# EAGLE design i2c_adc_avr_inline (EAGLE 6.4)
DATABASE: /home/mes/eagle/PARTSDB.txt
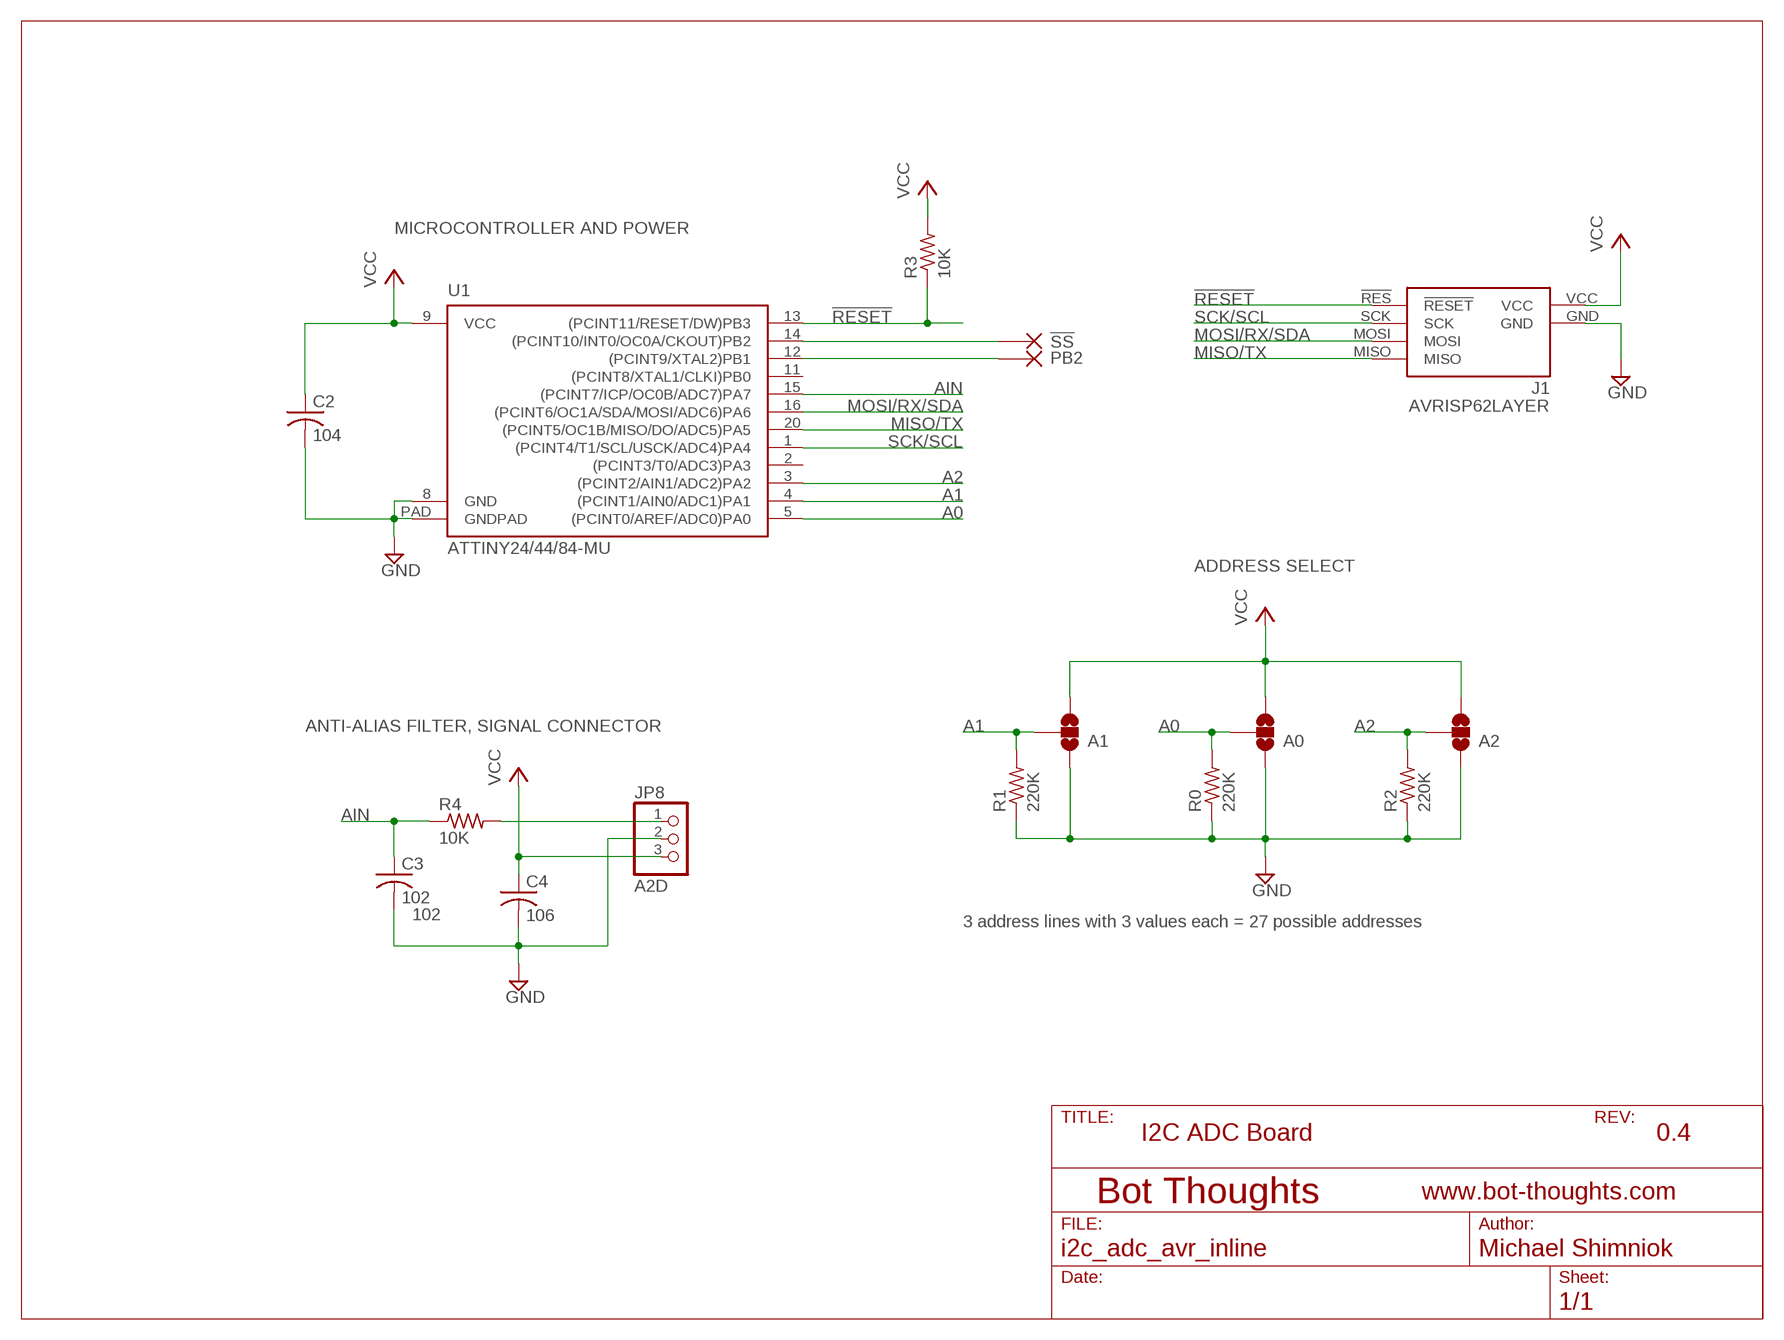
[diagram p0: schematic, sheet 1]

## Parts
A0  SOLDERJUMPER_2WAYS  [SJ_3]
A1  SOLDERJUMPER_2WAYS  [SJ_3]
A2  SOLDERJUMPER_2WAYS  [SJ_3]
C2  104  C-USC0603  [C0603]
C3  102  C-USC0603  [C0603]
C4  106  C-USC0603  [C0603]
J1  AVRISP62LAYER  [2X3_2LAYER]
JP8  A2D  PINHD-1X03_2.54-S  [1X03-S]
R0  220K  R-US_R0603  [R0603]
R1  220K  R-US_R0603  [R0603]
R2  220K  R-US_R0603  [R0603]
R3  10K  R-US_R0603  [R0603]
R4  10K  R-US_R0603  [R0603]
U1  ATTINY24/44/84-MU  [20MLF_0.5]
X1  !SS  PINPADSMD0.07X0.15  [PAD0.07X0.15]
X4  PB2  PINPADSMD0.07X0.15  [PAD0.07X0.15]

## Nets
!RESET: J1.!RES(!RESET) R3.1 U1.13((PCINT11/RESET/DW)PB3)
A0: A0.2 R0.2 U1.5((PCINT0/AREF/ADC0)PA0)
A1: A1.2 R1.2 U1.4((PCINT1/AIN0/ADC1)PA1)
A2: A2.2 R2.2 U1.3((PCINT2/AIN1/ADC2)PA2)
AIN: C3.1 R4.1 U1.15((PCINT7/ICP/OC0B/ADC7)PA7)
GND: A0.1 A1.1 A2.1 C2.2 C3.2 C4.2 J1.GND JP8.2 R0.1 R1.1 R2.1 U1.8(GND) U1.PAD(GNDPAD)
MISO/TX: J1.MISO U1.20((PCINT5/OC1B/MISO/DO/ADC5)PA5)
MOSI/RX/SDA: J1.MOSI U1.16((PCINT6/OC1A/SDA/MOSI/ADC6)PA6)
N$1: JP8.1 R4.2
N$3: U1.14((PCINT10/INT0/OC0A/CKOUT)PB2) X1.P$1
N$4: U1.12((PCINT9/XTAL2)PB1) X4.P$1
SCK/SCL: J1.SCK U1.1((PCINT4/T1/SCL/USCK/ADC4)PA4)
VCC: A0.3 A1.3 A2.3 C2.1 C4.1 J1.VCC JP8.3 R3.2 U1.9(VCC)
Unconnected: U1.2((PCINT3/T0/ADC3)PA3) U1.11((PCINT8/XTAL1/CLKI)PB0)

## Notes on the sheet
- MICROCONTROLLER AND POWER
- ADDRESS SELECT
- ANTI-ALIAS FILTER, SIGNAL CONNECTOR
- 3 address lines with 3 values each = 27 possible addresses
- I2C ADC Board | 0.4

## Library data of the parts
A0 A1 A2 = SparkFun:SOLDERJUMPER_2WAY: Solder Jumper 2 way solder jumper
C2 = rcl:C-US: CAPACITOR, American symbol; PARTNO: C1608X7R1E104K080AA
C3 = rcl:C-US: CAPACITOR, American symbol; CODE: 102; PARTNO: CL10B102KB8SFNC
C4 = rcl:C-US: CAPACITOR, American symbol; PARTNO: CL10A106MP8NNNC
J1 = mes_avr:AVRISP6: 6-pin dual-row connector for Atmel AVRISP programmer interface
JP8 = pinhead-2:PINHD-1X03: PIN HEADER
R0 R1 R2 = rcl:R-US_: RESISTOR, American symbol; PARTNO: RC1608J224CS
R3 R4 = rcl:R-US_: RESISTOR, American symbol; PARTNO: 1622829-1
U1 = mes_avr:ATTINY24/44/84: Atmel AVR ATtiny24/44/84 14-pin High Performance, Low Power AVR® 8-bit Microcontroller
X1 X4 = mes_electromech:PINPAD: PIN PAD (PINPAD) Generic pin pad connector

## Board
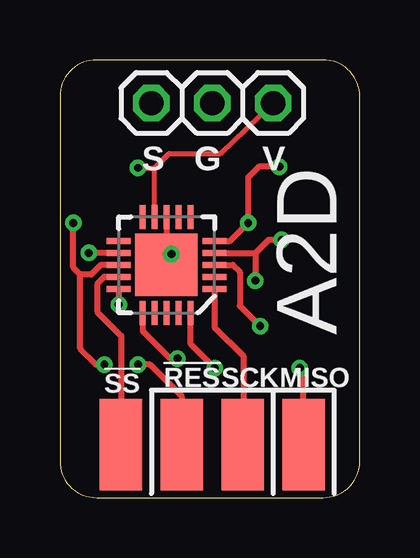
[diagram p1: board, top side]
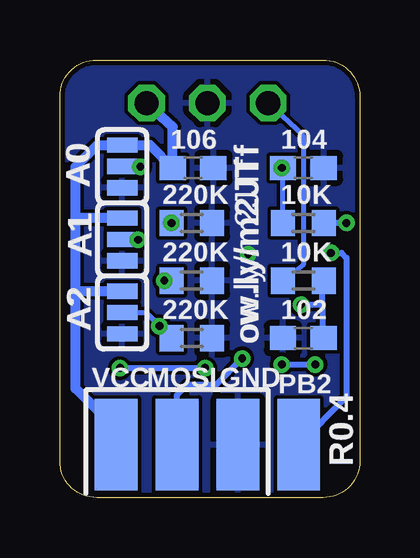
[diagram p2: board, bottom side, seen from below]

Size 12.51 x 18.25 mm. Coordinates in mm from the lower left corner, seen from the top.
Outline: 0,16.73 0,1.52 arc90 1.52,0 10.98,0 arc90 12.51,1.52 12.51,16.73 arc90 10.98,18.25 1.52,18.25 arc90 0,16.73
Copper layers (1*16): Top 0.0356mm / dielectric 1.5011mm / Bottom 0.0356mm
Design rules "default *": minimum track width 6mil, minimum drill 13mil, track to track 6mil, track to pad 6mil, pad to pad 6mil, via to via 6mil, smd to smd 6mil, copper to edge 8mil, drill to drill 6mil, minimum pad ring 7mil, minimum via ring 7mil, stop-mask expansion 4mil, vias tented up to drill 20mil, thermal gap 10mil

### Footprints (pad centres in the part's own frame; a part is rotated, then mirrored left to right if it is on the bottom)
SJ_3 = smd 0.635 x 1.27: 1 -0.889,0; 2 0,0; 3 0.889,0
C0603 = smd 1.1 x 1: 1 -0.85,0; 2 0.85,0
2X3_2LAYER = smd 1.778 x 3.81: !RES -2.54,0; MISO 2.54,0; SCK 0,0 | smd 1.778 x 3.81 bottom: GND -2.54,0; MOSI 0,0; VCC 2.54,0
1X03-S = drill 1.016 octagon: 1 -2.54,0; 2 0,0; 3 2.54,0
R0603 = smd 1 x 1.1: 1 -0.85,0; 2 0.85,0
20MLF_0.5 = smd 1 x 0.25: 1 0,3; 2 0,2.5; 3 0,2; 4 0,1.5; 5 0,1; 11 4,1; 12 4,1.5; 13 4,2; 14 4,2.5; 15 4,3 | smd 0.25 x 1: 6 1,0; 7 1.5,0; 8 2,0; 9 2.5,0; 10 3,0; 16 3,4; 17 2.5,4; 18 2,4; 19 1.5,4; 20 1,4 | smd 2.6 x 2.6: PAD 2.02,1.99
PAD0.07X0.15 = smd 1.778 x 3.81: P$1 0,0

### Placement (x,y rotation side)
A0  9.91,13.81 90 bottom
A1  9.91,10.77 90 bottom
A2  9.91,7.72 90 bottom
C2  2.35,13.75 0 bottom
C3  2.35,6.65 180 bottom
C4  6.95,13.75 0 bottom
J1  7.62,2.2 0 top
JP8  6.35,16.45 0 top
R0  7,11.45 180 bottom
R1  7,9.05 180 bottom
R2  7,6.65 180 bottom
R3  2.35,11.45 180 bottom
R4  2.35,9.05 180 bottom
U1  6.45,11.7 180 top
X1  2.54,2.2 0 top
X4  2.54,2.2 0 bottom

### Tracks (layer width: path | path; a pad name or v marks a point on that pad's centre or on a via)
!RESET  (via drill 0.33)
  Top 0.254: U1.13 1.7,9.7 1.3,9.3 0.85,9.3 | J1.!RES 5.08,4.22 3.75,5.55 v3.25,5.55 | 0.85,9.3 0.55,9.6 v0.55,11.45 | v1.85,5.55 1.5,5.55 0.85,6.2 0.85,9.3
  Bottom 0.254: v0.55,11.45 R3.1 | v3.25,5.55 v1.85,5.55
A0  (via drill 0.33)
  Top 0.254: U1.5 7.1,10.7 R0.2 7.85,13.35 8.3,13.8 v9.15,13.8
  Bottom 0.254: A0.2 v9.16,13.81 v9.15,13.8
  other vias: 7.85,11.45
A1  (via drill 0.33)
  Top 0.254: U1.4 8.15,10.2 | 8.15,10.2 v8.15,9.05 | v9.25,10.75 8.7,10.75 8.15,10.2
  Bottom 0.254: A1.2 9.27,10.77 v9.25,10.75 | R1.2 v8.15,9.05
A2  (via drill 0.33)
  Top 0.254: U1.3 7.2,9.7 7.5,9.4 7.5,8 v8.35,7.15
  Bottom 0.203: A2.2 8.92,7.72 v8.35,7.15 R2.2
AIN  (via drill 0.33)
  Top 0.254: U1.15 v2.45,8.05
  Bottom 0.254: v2.45,8.05 1.55,8.05 | 1.55,8.05 1.55,9 R4.1 | 1.55,8.05 1.55,6.7 C3.1
GND  (via drill 0.33)
  Top 0.203: 4.45,10.65 4.65,10.45 v4.65,10.15 4.45,9.7 4.25,9.73 U1.PAD
  Top 0.254: U1.8 4.45,10.65
  pour Bottom: 0,0 0,18.25 12.7,18.25 12.7,0
MISO/TX  (via drill 0.33)
  Top 0.254: J1.MISO 10.16,5.24 v10,5.4 | v6.45,5.4 5.45,6.4 U1.20
  Bottom 0.254: v10,5.4 v6.45,5.4
MOSI/RX/SDA  (via drill 0.33)
  Top 0.254: U1.16 3.45,6.95 4.6,5.8 v4.9,5.8
  Bottom 0.254: v4.9,5.8 6,4.7 7.2,4.7 7.62,4.28 J1.MOSI
N$1
  Bottom 0.203: R4.2 2.35,9.7 2.35,15.09 JP8.1
N$3
  Top 0.254: U1.14 1.85,9.2 1.55,8.9 1.55,7.75 2.55,6.75 X1.P$1
N$4  (via drill 0.33)
  Top 0.254: U1.12 v1.2,10.2
  Bottom 0.254: v1.2,10.2 0.75,10.2 0.55,10 0.55,4.19 X4.P$1
SCK/SCL
  Top 0.254: U1.1 6.45,7.1 7.65,5.9 7.65,2.03 J1.SCK
VCC  (via drill 0.33)
  Top 0.203: U1.9 3.95,13.75 | 3.95,13.75 4.55,14.35 6.69,14.35 JP8.3 | v3.25,13.75 3.95,13.75
  Bottom 0.203: C2.1 v3.25,13.75 3.2,13.6 R3.2
  Bottom 0.406: JP8.3 7.8,15.46 C4.1 8.75,14.7 A0.3 10.95,14.7 11.85,13.8 11.85,11.6 | J1.VCC 10.16,2.86 11.85,4.55 11.85,8.5 | 11.85,8.5 11.85,11.6 | A1.3 11.8,11.65 11.85,11.6 | A2.3 11.75,8.61 11.85,8.5

### Text on the board
bPlace: ow.ly/m2JTf | R0.4
tNames: S | G | V
tsilk: S | G | V | A2D | !RES | SCK | MISO | !SS
bsilk: 104 | 106 | A0 | 10K | 220K | 10K | 220K | A1 | 102 | 220K | A2 | ow.ly/m2JTf | GND | MOSI | VCC | R0.4 | PB2